# Altium schematic sheet USB.SchDoc
size B; SheetNumber: 3; SheetTotal: 8
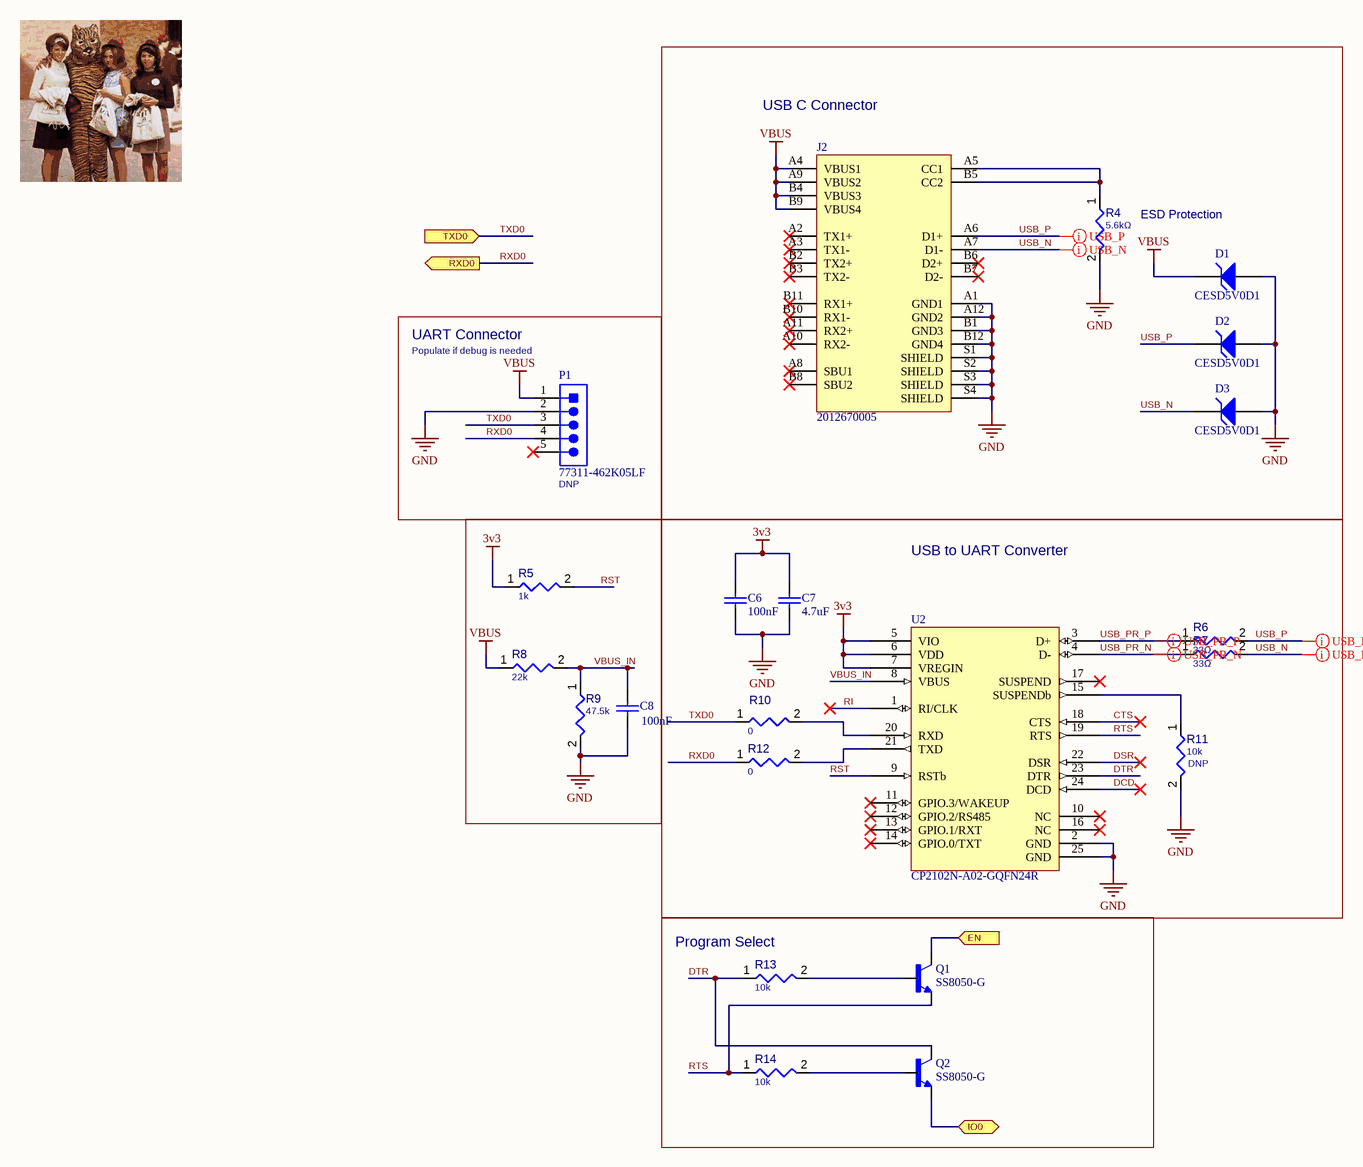
[diagram p0: USB.SchDoc]

## Parts
C6  Capacitance: 100nF  [Capacitor_0402]  (hidden comment: GRM155R71E104KE14D)
C7  Capacitance: 4.7uF  [Capacitor_0402]  (hidden comment: GRM155R60J475ME87D)
C8  Capacitance: 100nF  [Capacitor_0402]  (hidden comment: GRM155R71E104KE14D)
D1  CESD5V0D1  [JSCJ-SOD-123-2_V]
D2  CESD5V0D1  [JSCJ-SOD-123-2_V]
D3  CESD5V0D1  [JSCJ-SOD-123-2_V]
J2  2012670005  [2012670005-Footprint-1]
P1  77311-462K05LF  [FCI-77311-5_V]
Q1  SS8050-G  [SS8050-G-Footprint-1]
Q2  SS8050-G  [SS8050-G-Footprint-1]
R4  value 5.6kΩ  [RESC0402(1005)_L]  (hidden comment: 5D6KR2J)
R5  value 1k  [RESC0402(1005)_L]  (hidden comment: Resistor 1K +/-5 % 0402 63 mW)
R6  value 33Ω  [RESC0402(1005)_L]  (hidden comment: 33R2J)
R7  value 33Ω  [RESC0402(1005)_L]  (hidden comment: 33R2J)
R8  value 22k  [RESC0402(1005)_L]  (hidden comment: Resistor 22K  +/-1 % 0402 63 mW)
R9  value 47.5k  [RESC0402(1005)_L]  (hidden comment: Resistor 47K5 +/-1 % 0402 63 mW)
R10  value 0  [RESC0402(1005)_L]  (hidden comment: Jumper 0402)
R11  value 10k  [RESC0402(1005)_L]  (hidden comment: Resistor 10K  +/-1 % 0402 63 mW)
R12  value 0  [RESC0402(1005)_L]  (hidden comment: Jumper 0402)
R13  value 10k  [RESC0402(1005)_L]  (hidden comment: Resistor 10K  +/-1 % 0402 63 mW)
R14  value 10k  [RESC0402(1005)_L]  (hidden comment: Resistor 10K  +/-1 % 0402 63 mW)
U2  CP2102N-A02-GQFN24R  [CP2102N-A02-GQFN24R-Footprint-1]

## Blocks framed on the sheet
USB C Connector: D1-D3 J2 R4
UART Connector: P1
USB to UART Converter: C6 C7 R6 R7 R10-R12 U2
Program Select: Q1 Q2 R13 R14

## Ports
EN (in), IO0 (bidir), RXD0 (out), TXD0 (in)

## Nets
3v3: C6.2 C7.2 R5.1 U2.5(VIO) U2.6(VDD) U2.7(VREGIN)
GND: C6.1 C7.1 C8.1 D1.1(A) D2.1(A) D3.1(A) J2.A1(GND1) J2.A12(GND2) J2.B1(GND3) J2.B12(GND4) J2.S1(SHIELD) J2.S2(SHIELD) J2.S3(SHIELD) J2.S4(SHIELD) P1.2(RXI) R4.2 R9.2 R11.2 U2.2(GND) U2.25(GND)
VBUS: D1.2(K) J2.A4(VBUS1) J2.A9(VBUS2) J2.B4(VBUS3) J2.B9(VBUS4) P1.1(DTR) R8.1
CTS: U2.18(CTS)
DCD: U2.24(DCD)
DSR: U2.22(DSR)
DTR: Q2.3(C) R13.1 U2.23(DTR)
EN: Q1.3(C) ; port EN
IO0: Q2.2(E) ; port IO0
RI: U2.1(RI/CLK)
RST: R5.2 U2.9(RSTb)
RTS: Q1.2(E) R14.1 U2.19(RTS)
RXD0: P1.4(VCC) R12.1 ; port RXD0
TXD0: P1.3(TXO) R10.1 ; port TXD0
USB_N: D3.2(K) J2.A7(D1-) R7.2
USB_P: D2.2(K) J2.A6(D1+) R6.2
USB_PR_N: R7.1 U2.4(D-)
USB_PR_P: R6.1 U2.3(D+)
VBUS_IN: C8.2 R8.2 R9.1 U2.8(VBUS)
NetJ2_A5: J2.A5(CC1) J2.B5(CC2) R4.1
NetQ1_1: Q1.1(B) R13.2
NetQ2_1: Q2.1(B) R14.2
NetR10_2: R10.2 U2.20(RXD)
NetR11_1: R11.1 U2.15(SUSPENDb)
NetR12_2: R12.2 U2.21(TXD)

Not connected (* = marked no-connect by the designer): J2 A2(TX1+)* A3(TX1-)* A8(SBU1)* A10(RX2-)* A11(RX2+)* B2(TX2+)* B3(TX2-)* B6(D2+)* B7(D2-)* B8(SBU2)* B10(RX1-)* B11(RX1+)*; P1 5(CTS)*; U2 10(NC)* 11(GPIO.3/WAKEUP)* 12(GPIO.2/RS485)* 13(GPIO.1/RXT)* 14(GPIO.0/TXT)* 16(NC)* 17(SUSPEND)*

## Layout directives
differential pair; net class USB: USB_N, USB_P, USB_PR_N, USB_PR_P

## Notes on the sheet
- ESD Protection
- (near P1) Populate if debug is needed

## Library data of the parts
C6 C8 = CMP-001-00084-3: Chip Capacitor 100nF 0402 25V X7R
C7 = CMP-00000-1: 6.3V 4.7uF X5R ±20% 0402 Multilayer Ceramic Capacitors MLCC - SMD/SMT ROHS; Thickness: 0.022inch; Min Operating Temperature: -55°C; Case Code (Metric): 1005; Depth: 0.5mm; Tolerance: 20%; Width: 0.02inch; Series: GRM; Length: 1mm; Height: 0.5mm; Lead Free: Lead Free; Dielectric: X5R; Construction: Flat; REACH SVHC: No SVHC; Mount: Surface Mount; Radiation Hardening: No; Voltage Rating: 6.3V; RoHS Compliant: Yes; Packaging: Tape and Reel; Voltage Rating (DC): 6.3V; Package Quantity: 1; Max Operating Temperature: 85°C; Case Code (Imperial): 0402; JLCPCB Part #: C23733
D1-D3 = CMP-004-00020-1: Uni-driection ESD Protection Diode, 5 V, 1 uA, 2-Pin SOD-123, RoHS, Tape and Reel; Manufacturer: Jiangsu Changjiang Electronics Technology; Mounting Technology: SM; Case/Package: SOD-123-2; Package Description: 2-Pin Surface Mount Device, Body 2.7 x 1.6 mm; Package Reference: SOD-123-2; RoHS Compliant: Unknown; Package URL: http://www.cj-elec.com/txUpfile/201412112231195145.pdf; Datasheet URL: http://www.cj-elec.com/gallery/txUpfile/f05a5831e2d7f622a930855050fbe076.pdf; Datasheet Version: Rev. B, 04/2014
  D1: JLCPCB Part #: C85649
J2 = CMP-002-00076-2: Conn USB 3.1 Type C F 24 POS 0.5mm Solder RA SMD 24 Terminal 1 Port T/R; JLCPCB Part #: C565324
P1 = CMP-002-00021-1: Male Header, Pitch 2.54 mm, 1 x 5 Position, Height 16.24 mm, Tail Length 3.05 mm, -65 to 125 degC, RoHS, Tape and Reel; Manufacturer: FCI Electronics; Gender: Male; Mounting Technology: TH; Connector Type: Header; Package Reference: 77311-5; Case/Package: 77311-5; RoHS Compliant: Unknown; Datasheet URL: http://portal.fciconnect.com/Comergent//fci/drawing/77311.pdf; Manufacturer URL: http://portal.fciconnect.com/; Package Description: Male Header, Pitch 2.54 mm, 1 x 5 Position, Height 16.24 mm, Tail Length 3.05 mm; Datasheet Version: Rev. CK, 07/2016; DNP: DNP
Q1 Q2 = CMP-013-00035-1: Trans Gp Bjt NPN 25V 1.5A 300MW 3-PIN SOT-23 T/r
  Q1: JLCPCB Part #: C2150
R4 = CMP-009-00108-1: 5K6 0.063W 5% 0402 (1005 Metric)  SMD; Power: 63mW; Mounting Technology: SMT; Pins: 2; Tolerance: 5%; Case/Package: 0402; JLCPCB Part #: C25908
R5 = CMP-009-00157-2: Chip Resistor, 1 kOhms, +/-5 %, 63 mW, -55 to 155 degC, 0402; Power: 63mW; Tolerance: 5%; Min Operating Temperature: -55°C; Max Operating Temperature: 155°C; Pins: 2; Case/Package: 0402; JLCPCB Part #: C11702
R6 R7 = CMP-009-00096-1: 33R 0.063W 5% 0402 (1005 Metric)  SMD; Power: 63mW; Tolerance: 5%; Mounting Technology: SMT; Pins: 2; Case/Package: 0402
  R6: JLCPCB Part #: C25105
R8 = CMP-009-00123-2: Chip Resistor, 22 kOhms, +/-1 %, 63 mW, -55 to 155 degC, 0402; Power: 63mW; Tolerance: 1%; Min Operating Temperature: -55°C; Max Operating Temperature: 155°C; Pins: 2; Case/Package: 0402; JLCPCB Part #: C25768
R9 = CMP-009-00137-2: Chip Resistor, 47,5 kOhms, +/-1 %, 63 mW, -55 to 155 degC, 0402; Tolerance: 1%; Power: 63mW; Pins: 2; Case/Package: 0402; Max Operating Temperature: 155°C; Min Operating Temperature: -55°C; JLCPCB Part #: C227098
R10 R12 = CMP-009-00148-2: Max Operating Temperature: 155°C; Pins: 2; Case/Package: 0402; Min Operating Temperature: -55°C
  R10: JLCPCB Part #: C17168
R11 R13 R14 = CMP-009-00149-2: Chip Resistor, 10 kOhms, +/-1 %, 63 mW, -55 to 125 degC, 0402; Power: 63mW; Tolerance: 1%; Pins: 2; Max Operating Temperature: 155°C; Min Operating Temperature: -55°C; Case/Package: 0402
  R11: DNP: DNP
U2 = CMP-002-00074-1: Full Speed USB to UART Bridge USB 2.0 3.3V T/R Automotive 24-Pin QFN EP